# EAGLE design THAPMU _1.0 (EAGLE 9.6.2)
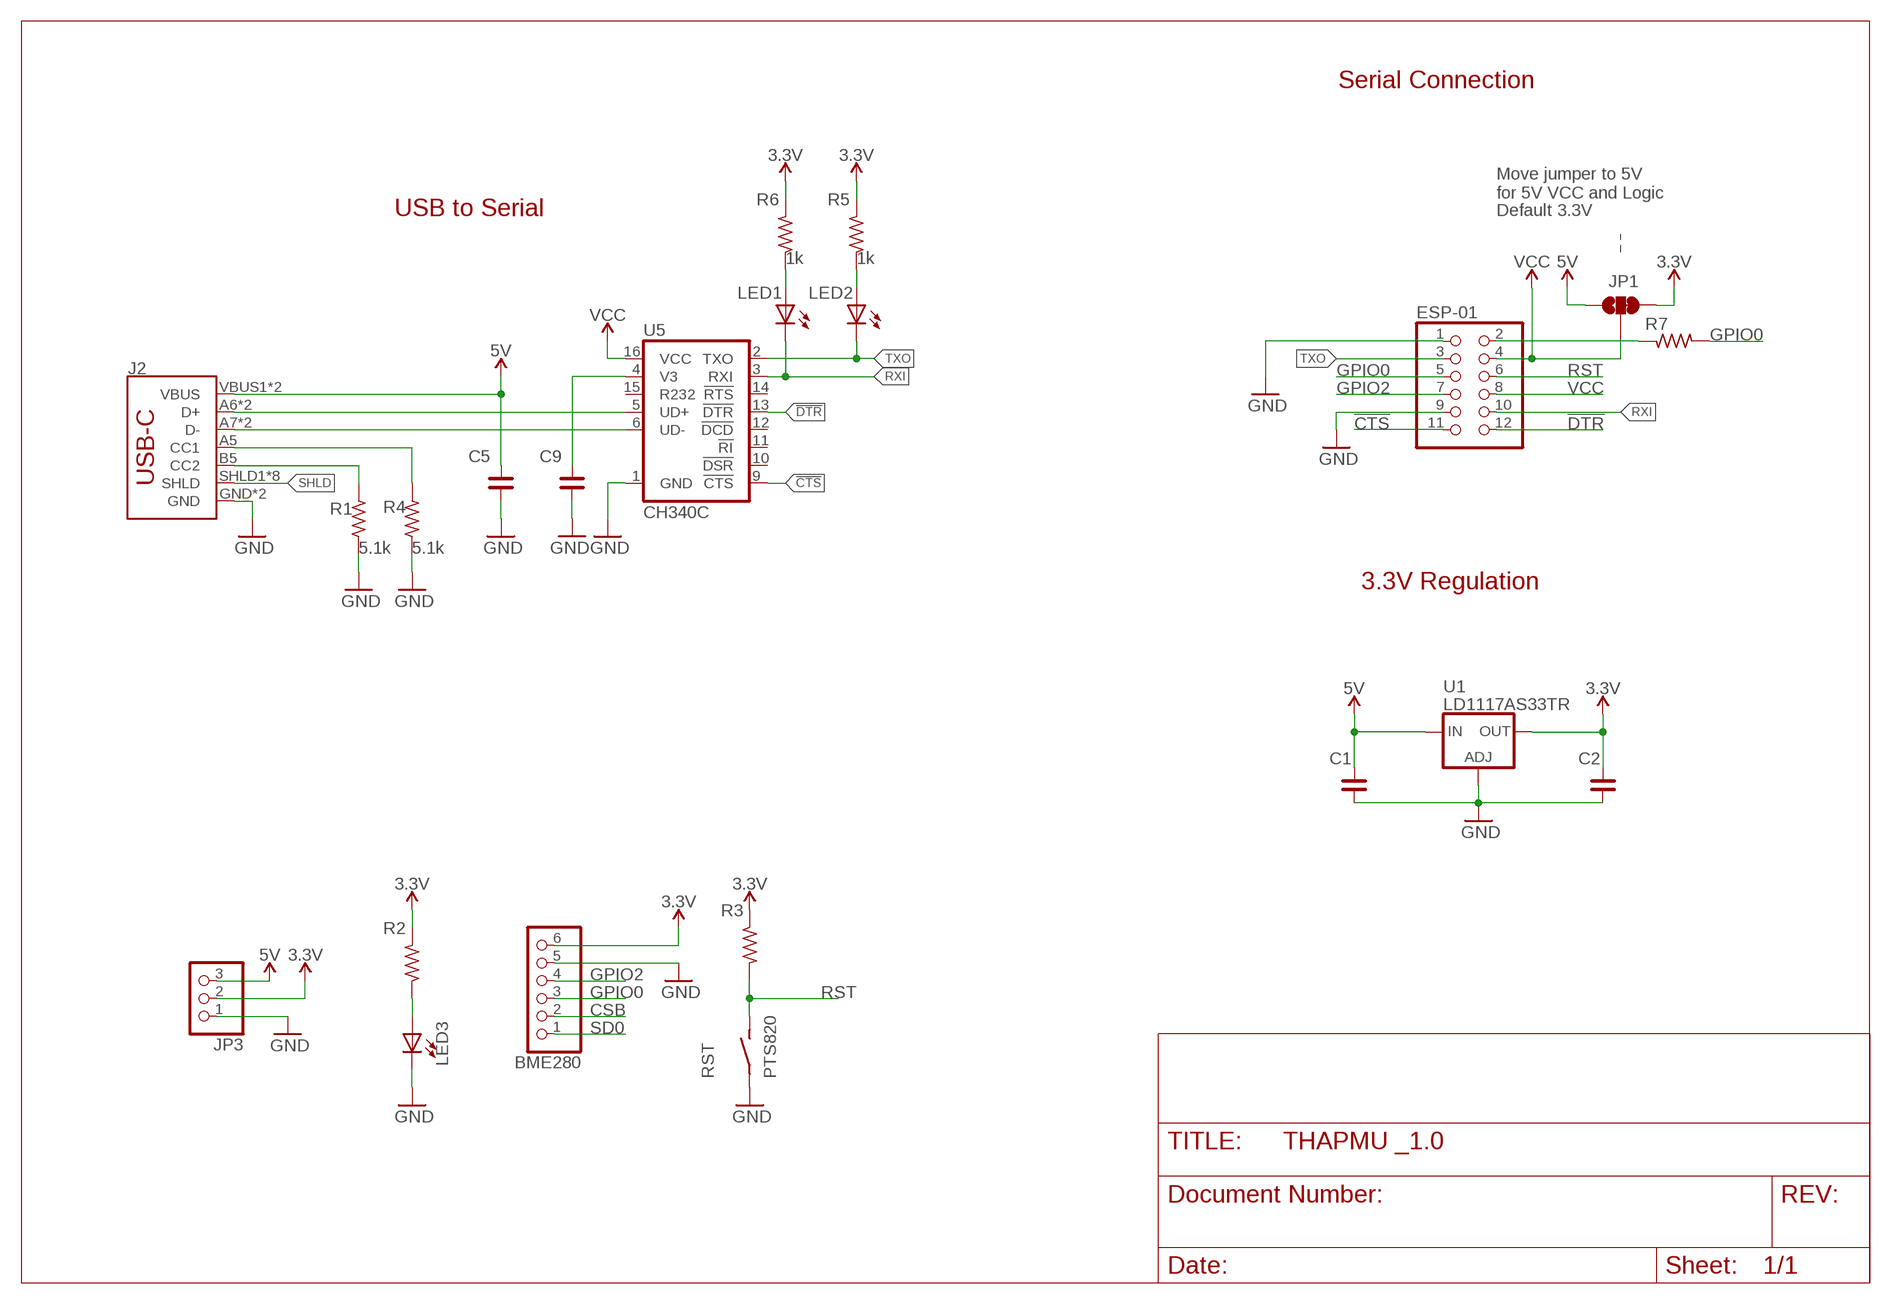
[diagram p0: schematic, sheet 1]

## Parts
BME280  PINHD-1X6  [1X06]
C1  0.1uF  C_1206  [C1206]
C2  10uF  C_1206  [C1206]
C5  0.1uF  C_1206  [C1206]
C9  10nF  C_1206  [C1206]
ESP-01  PINHD-2X6  [2X06]
J2  USB_C16PIN  [USB-C-16P]
JP1  JUMPER-SMT_3_1-NC_TRACE_SILK  [SMT-JUMPER_3_1-NC_TRACE_SILK]
JP3  PINHD-1X3_2.00  [1X03M]
LED1  GREEN  LEDSMT1206  [1206]
LED2  Yellow  LEDSMT1206  [1206]
LED3  BLUE  LEDSMT1206  [1206]
R1  5.1k  R_1206  [R1206]
R2  1k  R_1206  [R1206]
R3  1k  R_1206  [R1206]
R4  5.1k  R_1206  [R1206]
R5  1k  R_1206  [R1206]
R6  1k  R_1206  [R1206]
R7  1k  R_1206  [R1206]
RST  PTS820  [PTS820]
U1  LD1117AS33TR  LD117AS33TR  [SOT223]
U5  CH340C  [SO016]

## Nets
3.3V [power]: BME280.6 C2.1 JP1.3 JP3.2 R2.2 R3.2 R5.2 R6.2 U1.4(OUT)
5V: C1.1 C5.1 J2.VBUS1(VBUS) J2.VBUS2(VBUS) JP1.1 JP3.3 U1.3(IN)
!CTS: ESP-01.11 U5.9(!CTS)
!DTR: ESP-01.12 U5.13(!DTR)
CC1: J2.A5(CC1) R4.2
CC2: J2.B5(CC2) R1.2
CSB: BME280.2
D+: J2.A6(D+) J2.B6(D+) U5.5(UD+)
D-: J2.A7(D-) J2.B7(D-) U5.6(UD-)
GND [power]: BME280.5 C1.2 C2.2 C5.2 C9.2 ESP-01.1 ESP-01.9 J2.GND J2.GND2(GND) JP3.1 LED3.C R1.1 R4.1 RST.1(P) U1.1(ADJ) U5.1(GND)
GPIO0: BME280.3 ESP-01.5 R7.2
GPIO2: BME280.4 ESP-01.7
N$1: C9.1 U5.4(V3)
N$2: LED3.A R2.1
N$3: ESP-01.2 R7.1
N$10: LED1.A R6.1
N$11: LED2.A R5.1
RST: ESP-01.6 R3.1 RST.2(S)
RXI: ESP-01.10 LED1.C U5.3(RXI)
SD0: BME280.1
SHLD: J2.SHLD1(SHLD) J2.SHLD2(SHLD) J2.SHLD3(SHLD) J2.SHLD4(SHLD) J2.SHLD5(SHLD) J2.SHLD6(SHLD) J2.SHLD7(SHLD) J2.SHLD8(SHLD)
TXO: ESP-01.3 LED2.C U5.2(TXO)
VCC: ESP-01.4 ESP-01.8 JP1.2 U5.16(VCC)
Unconnected: U5.10(!DSR) U5.11(!RI) U5.12(!DCD) U5.14(!RTS) U5.15(R232)

## Notes on the sheet
- Serial Connection
- Move jumper to 5V
  for 5V VCC and Logic
- USB to Serial | Default 3.3V
- 3.3V Regulation

## Library data of the parts
BME280 = pinhead:PINHD-1X6: PIN HEADER
C1 C2 C5 C9 = rc-master-smd:C_: NON-POLARIZED CAP
ESP-01 = pinhead:PINHD-2X6: PIN HEADER
J2 = SparkFun-Connectors:USB_C: USB Type C 16Pin Connector Super Speed pins not available on the 16-pin purely SMD connector so this part is best for USB 2.0 implementations. D1 and D2 are tied together enabling D+/- no matter which way the cable is plugged into the connector. The two channel configuration pins (CC1/2) are exposed. These are normally connected to ground via 5.1k resistors but can be reconfigured for high current/high power applications.; PROD_ID: CONN-14122
JP1 = SparkFun-Jumpers:JUMPER-SMT_3_1-NC_TRACE: Normally closed trace jumper (1 of 2 connections) This jumper has a trace between two pads so it's normally closed (NC). The other connection is normally open (NO). Use a razor knife to open the connection. For best results follow the IPC guidelines for cutting traces: Cutout at least 0.063 mm (0.005 in). Remove all loose material to clean up the cut area. Seal the cut with an approved epoxy. Reapply solder to reclose the connection, or to close the NO connection.
JP3 = pinhead-ext:PINHD-1X3: PIN HEADER
LED1-LED3 = led:LED: LED OSRAM: - CHIPLED LG R971, LG N971, LY N971, LG Q971, LY Q971, LO R971, LY R971 LH N974, LH R974 LS Q976, LO Q976, LY Q976 LO Q996 - Hyper CHIPLED LW Q18S LB Q993, LB Q99A, LB R99A - SideLED LS A670, LO A670, LY A670, LG A670, LP A670 LB A673, LV A673, LT A673, LW A673 LH A674 LY A675 LS A676, LA A676, LO A676, LY A676, LW A676 LS A679, LY A679, LG A679 - Hyper Micro SIDELED® LS Y876, LA Y876, LO Y876, LY Y876 LT Y87S - SmartLED LW L88C, LW L88S LB L89C, LB L89S, LG L890 LS L89K, LO L89K, LY L89K LS L896, LA L896, LO L896, LY L896 - TOPLED LS T670, LO T670, LY T670, LG T670, LP T670 LSG T670, LSP T670, LSY T670, LOP T670, LYG T670 LG T671, LOG T671, LSG T671 LB T673, LV T673, LT T673, LW T673 LH T674 LS T676, LA T676, LO T676, LY T676, LB T676, LH T676, LSB T676, LW T676 LB T67C, LV T67C, LT T67C, LS T67K, LO T67K, LY T67K, LW E67C LS E67B, LA E67B, LO E67B, LY E67B, LB E67C, LV E67C, LT E67C LW T67C LS T679, LY T679, LG T679 LS T770, LO T770, LY T770, LG T770, LP T770 LB T773, LV T773, LT T773, LW T773 LH T774 LS E675, LA E675, LY E675, LS T675 LS T776, LA T776, LO T776, LY T776, LB T776 LHGB T686 LT T68C, LB T68C - Hyper Mini TOPLED® LB M676 - Mini TOPLED Santana® LG M470 LS M47K, LO M47K, LY M47K Source: http://www.osram.convergy.de/
R1 R4 = rc-master-smd:R_: RESISTOR; V: 5.1k
R2 R3 R7 = rc-master-smd:R_: RESISTOR
R5 R6 = rc-master-smd:R_: RESISTOR; V: 1k
RST = switch-ck:PTS820: C&K Components PTS820 Series Microminiature SMT Top Actuated
U1 = v-reg:LD117A?*: Low drop fixed and adjustable positive voltage regulators 1 A Source: http://www.st.com/stonline/products/literature/ds/7194/ld1117axx.pdf
U5 = SparkFun-IC-Comms:CH340C; PROD_ID: IC-14038

## Net classes
1 power: width 0.178 mm

## Board
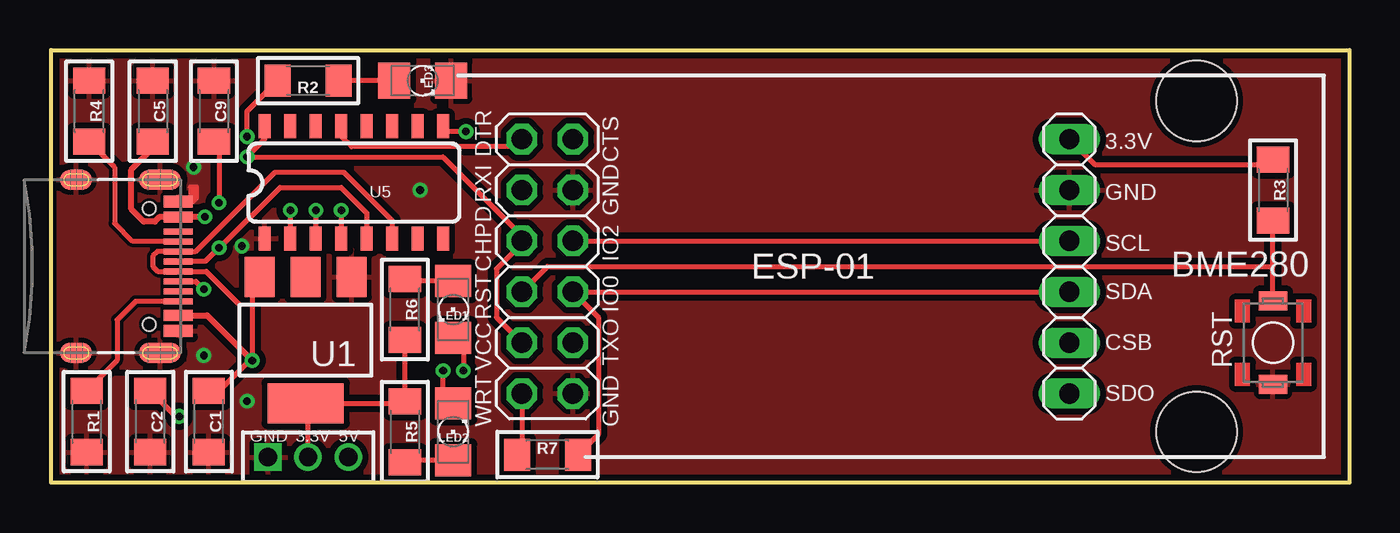
[diagram p1: board, top side]
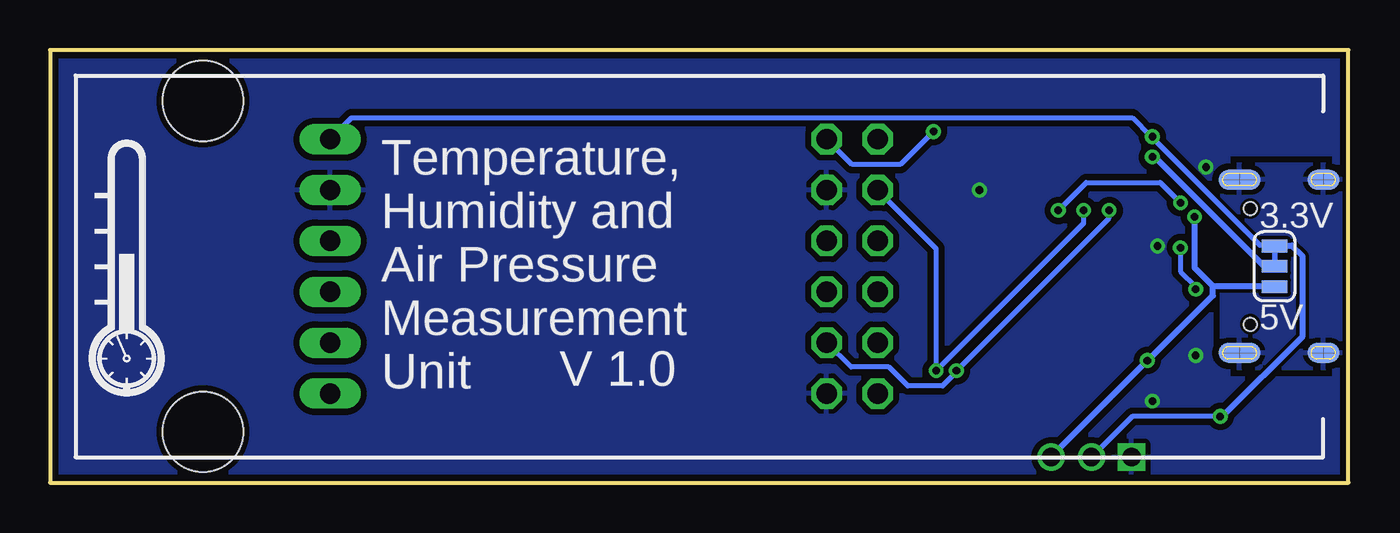
[diagram p2: board, bottom side, seen from below]

Size 64.77 x 21.59 mm. Coordinates in mm from the lower left corner, seen from the top.
Outline: 64.77,0 0,0 0,21.59 64.77,21.59 64.77,0
Copper layers (1*16): Top 0.035mm / dielectric 1.5mm / Bottom 0.035mm
Design rules "SparkFun-2-layer-TIGHT": minimum track width 7mil, minimum drill 15mil, track to track 7mil, track to pad 7mil, pad to pad 7mil, via to via 7mil, smd to smd 7mil, copper to edge 7mil, drill to drill 7mil, minimum pad ring 7mil, minimum via ring 7mil, stop-mask expansion 4mil, vias tented up to drill 25mil, thermal gap 10mil
Holes 4 mm at 57.15,2.54 57.15,19.05

### Footprints (pad centres in the part's own frame; a part is rotated, then mirrored left to right if it is on the bottom)
1X06 = drill 1.016 long: 1 -6.35,0; 2 -3.81,0; 3 -1.27,0; 4 1.27,0; 5 3.81,0; 6 6.35,0
C1206 = smd 1.3 x 1.6: 1 -1.524,0; 2 1.524,0
2X06 = drill 1.016 octagon: 1 -6.35,-1.27; 2 -6.35,1.27; 3 -3.81,-1.27; 4 -3.81,1.27; 5 -1.27,-1.27; 6 -1.27,1.27; 7 1.27,-1.27; 8 1.27,1.27; 9 3.81,-1.27; 10 3.81,1.27; 11 6.35,-1.27; 12 6.35,1.27
USB-C-16P = smd 0.3 x 1.45: A5 -1.25,0; A6 -0.25,0; A7 0.25,0; A8 1.25,0; B5 1.75,0; B6 0.75,0; B7 -0.75,0; B8 -1.75,0 | smd 0.6 x 1.45: GND -3.225,0; GND2 3.225,0 | smd 1 x 2.1: SHLD1 -4.32,-0.915; SHLD2 4.32,-0.915 | smd 1 x 2.1 bottom: SHLD3 -4.32,-0.915; SHLD4 4.32,-0.915 | smd 1 x 1.6: SHLD5 -4.32,-5.095; SHLD8 4.32,-5.095 | smd 1 x 1.6 bottom: SHLD6 -4.32,-5.095; SHLD7 4.32,-5.095 | smd 0.55 x 1.45: VBUS1 -2.45,0; VBUS2 2.45,0 | hole 0.65: -2.89,-1.445; 2.89,-1.445
SMT-JUMPER_3_1-NC_TRACE_SILK = smd 0.635 x 1.27: 1 -1.016,0; 2 0,0; 3 1.016,0
1X03M = drill 0.914 square: 1 -2,0 | drill 0.914: 2 0,0; 3 2,0
1206 = smd 1.6 x 1.803: A -1.422,0; C 1.422,0
R1206 = smd 1.3 x 1.6: 1 -1.524,0; 2 1.524,0
PTS820 = smd 0.95 x 1.4: 1 -2.075,0; 2 2.075,0
SOT223 = smd 1.5 x 2: 1 -2.3,-3.15; 2 0,-3.15; 3 2.3,-3.15 | smd 3.8 x 2: 4 0,3.15
SO016 = smd 0.6 x 1.2: 1 -4.445,-2.8; 2 -3.175,-2.8; 3 -1.905,-2.8; 4 -0.635,-2.8; 5 0.635,-2.8; 6 1.905,-2.8; 7 3.175,-2.8; 8 4.445,-2.8; 9 4.445,2.8; 10 3.175,2.8; 11 1.905,2.8; 12 0.635,2.8; 13 -0.635,2.8; 14 -1.905,2.8; 15 -3.175,2.8; 16 -4.445,2.8

### Placement (x,y rotation side)
BME280  50.8,10.79 90 top
C1  7.87,3.05 270 top
C2  4.95,3.05 270 top
C5  5.08,18.54 90 top
C9  8.13,18.54 90 top
ESP-01  24.77,10.79 90 top
J2  6.35,10.79 270 top
JP1  3.68,10.79 90 bottom
JP3  12.83,1.27 0 top
LED1  20.07,8.64 270 top
LED2  20.07,2.54 90 top
LED3  18.54,20.07 0 top
R1  1.78,3.05 90 top
R2  12.83,20.07 180 top
R3  60.96,14.61 90 top
R4  1.91,18.54 270 top
R5  17.65,2.54 90 top
R6  17.65,8.64 270 top
R7  24.77,1.4 0 top
RST  60.96,6.99 90 top
U1  12.7,7.11 180 top
U5  15.11,14.99 0 top
U$1  [THAPMU]  60.96,11.43 0 top

### Tracks (layer width: path | path; a pad name or v marks a point on that pad's centre or on a via)
3.3V  (via drill 0.38)
  Top 0.254: BME280.6 52.07,15.88 60.71,15.88 R3.2 | R6.2 R5.2 17.55,3.96 U1.4 12.83,3.83 JP3.2 | 11.43,19.94 R2.2 9.78,18.54 v9.78,17.27 | C2.1 6.22,3.3 v6.4,3.3
  Bottom 0.178: 9.86,17.27 v9.78,17.27
  Bottom 0.254: 3.81,11.84 4.41,11.84 9.78,17.21 v9.78,17.27 | BME280.6 49.73,18.21 10.79,18.21 9.86,17.27 | v6.4,3.3 10.79,3.3 JP3.2
  Bottom 0.305: v6.4,3.3 6.28,3.3 2.29,7.3 2.29,11.3 2.82,11.84 3.81,11.84 3.79,11.81 JP1.3
5V  (via drill 0.38)
  Top 0.254: U1.3 10.03,9.89 10.03,6.22 | 10.03,6.22 8.38,4.57 C1.1 | v10.03,6.1 10.03,6.22
  Top 0.305: J2.VBUS2 7.78,8.35 v10.03,6.1 | v7.68,13.27 7.66,13.24 J2.VBUS1 5.39,13.24 5.18,13.03 4.63,13.03 4,13.66 4,15.62 5.08,16.7 C5.1
  Bottom 0.305: 6.76,9.78 6.76,9.33 10,6.1 v10.03,6.1 14.83,1.3 JP3.3 | 6.76,9.78 6.76,9.81 7.68,10.73 v7.68,13.27 | JP1.1 6.76,9.78
!CTS  (via drill 0.38)
  Top 0.254: U5.9 19.81,17.53 v20.7,17.53
  Bottom 0.254: v20.7,17.53 22.35,15.88 24.77,15.88 ESP-01.11
!DTR
  Top 0.178: 23.11,16.76 ESP-01.12
  Top 0.254: U5.13 14.48,17.28 14.99,16.76 23.11,16.76
CC1
  Top 0.254: R4.2 3.17,15.75 3.17,12.95 4.08,12.04 J2.A5
CC2
  Top 0.254: R1.2 3.3,6.1 3.3,8.13 4.22,9.04 J2.B5
D+  (via drill 0.38)
  Top 0.254: J2.B6 7.23,10.04 v7.62,9.65 | v8.38,11.73 7.7,11.04 J2.A6 | 8.42,11.73 11.43,14.73 14.48,14.73 15.75,13.46 U5.5
  Top 0.305: v8.38,11.73 8.42,11.73 | 8.42,11.73
  Bottom 0.254: v8.38,11.73 8.38,10.54 7.62,9.78 v7.62,9.65
D-
  Top 0.254: 9.4,8.89 7.74,10.54 J2.A7 5.34,10.54 5.33,10.54 5.08,10.79 5.08,11.3 5.32,11.54 J2.B7 7.23,11.54 11.18,15.49 14.61,15.49 17.02,13.08 U5.6
GND  (via drill 0.38)
  Top 0.305: J2.GND 7.04,14.02 | 7.04,14.02 7.24,14.22 7.24,14.73 6.99,14.73 6.99,14.07 7.04,14.02
  other vias: 7.11,15.75 9.53,11.81 9.78,4.06 7.62,6.35 18.41,14.61
  pour Top (isolate 0.305, rank 3): 0,21.59 64.77,21.59 64.77,0 0,0
  pour Bottom (isolate 0.305, rank 3): 0,21.59 64.77,21.59 64.77,0 0,0
GPIO0
  Top 0.254: BME280.3 ESP-01.5 27.3,8.26 27.3,2.41 R7.2
GPIO2
  Top 0.254: ESP-01.7 BME280.4
N$1  (via drill 0.38)
  Top 0.254: C9.1 8.38,16.76 v8.38,13.97 | v14.48,13.59 U5.4
  Bottom 0.254: v14.48,13.59 13.08,14.99 9.4,14.99 v8.38,13.97
N$2
  Top 0.254: LED3.A R2.1
N$3
  Top 0.254: ESP-01.2 23.5,1.65 R7.1
N$10
  Top 0.254: LED1.A 17.75,10.06 R6.1
N$11
  Top 0.254: LED2.A 17.75,1.12 R5.1
RST
  Top 0.254: RST.2 60.96,10.79 | 60.96,10.79 R3.1 | 60.96,10.79 24.77,10.79 ESP-01.6
RXI  (via drill 0.38)
  Top 0.254: LED1.C 20.57,6.71 v20.57,5.59 | v13.21,13.59 U5.3
  Bottom 0.254: v13.21,13.59 13.21,12.95 v20.57,5.59 20.57,11.68 ESP-01.10
SHLD
  pour Bottom: 0,15.88 6.35,15.88 6.35,5.71 0,5.71
  pour Top: 0,15.88 6.35,15.88 6.35,5.71 0,5.71
TXO  (via drill 0.38)
  Top 0.254: LED2.C 19.56,4.47 v19.56,5.59 | v11.94,13.59 U5.2
  Bottom 0.254: v11.94,13.59 11.94,13.21 v19.56,5.59 19.56,5.53 20.26,4.83 21.99,4.83 22.93,5.77 24.82,5.77 ESP-01.3
VCC  (via drill 0.38)
  Top 0.254: ESP-01.4 22.23,8.26 22.23,10.67 23.5,11.94 ESP-01.8 23.5,12.32 19.56,16.26 v9.78,16.26 10.67,17.15 U5.16
  Bottom 0.305: JP1.2 4.19,10.79 9.65,16.26 v9.78,16.26

### Text on the board
tNames: 3.3V | DTR | CTS | RXI | GND | GND | SCL | CHPD | IO2 | IO0 | SDA | RST | CSB | VCC | TXO | RST | SDO | WRT | GND | GND | 3.3V | 5V
bNames: 3.3V | 5V | V 1.0 | Temperature, / Humidity and / Air Pressure / Measurement / Unit
tValues: Close
Measures: All dimensions in inches